# EasyEDA Pro project 4片ADS1299级联.epro, board PCB1
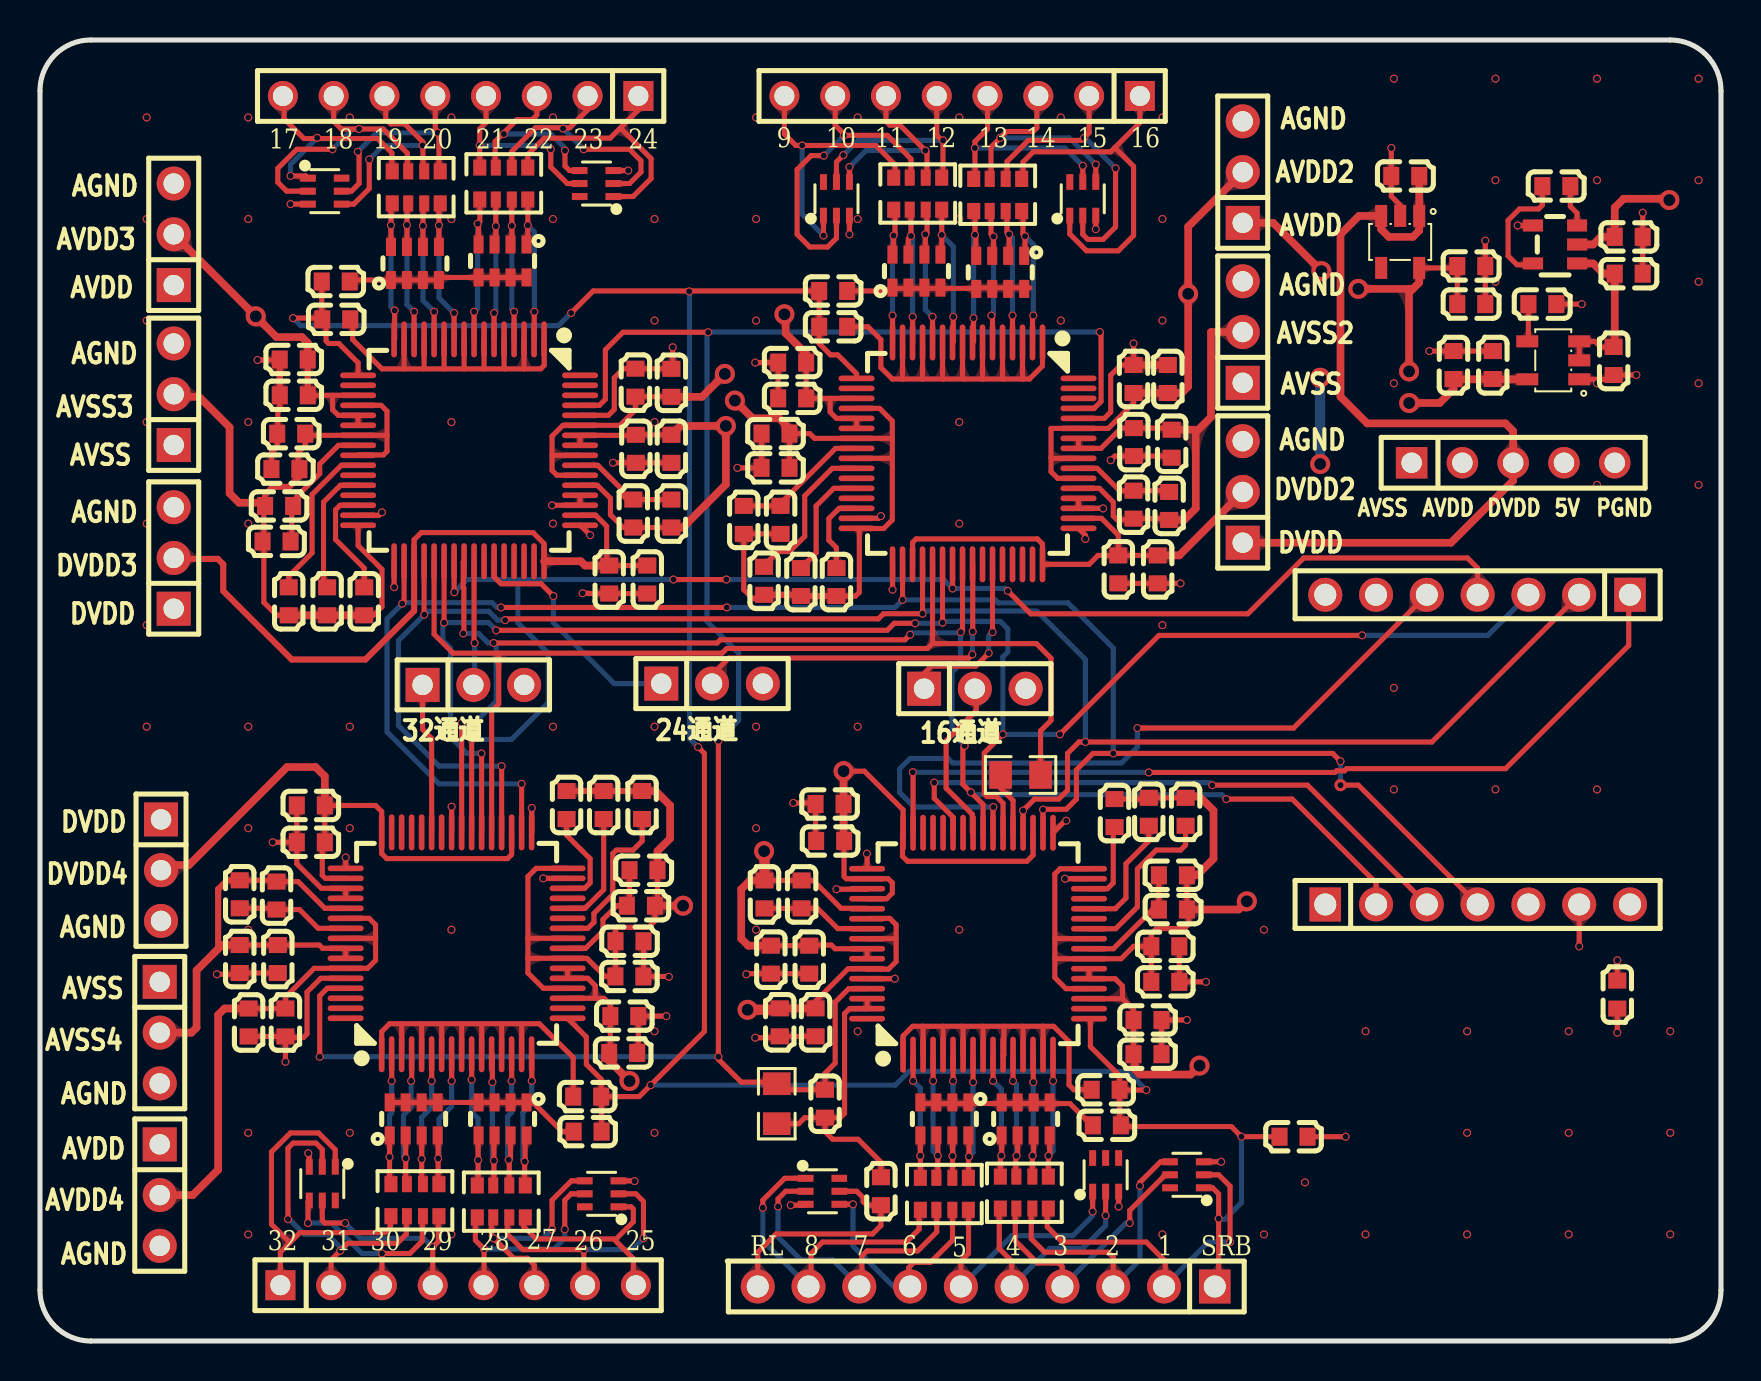
[diagram p4: board, top side]
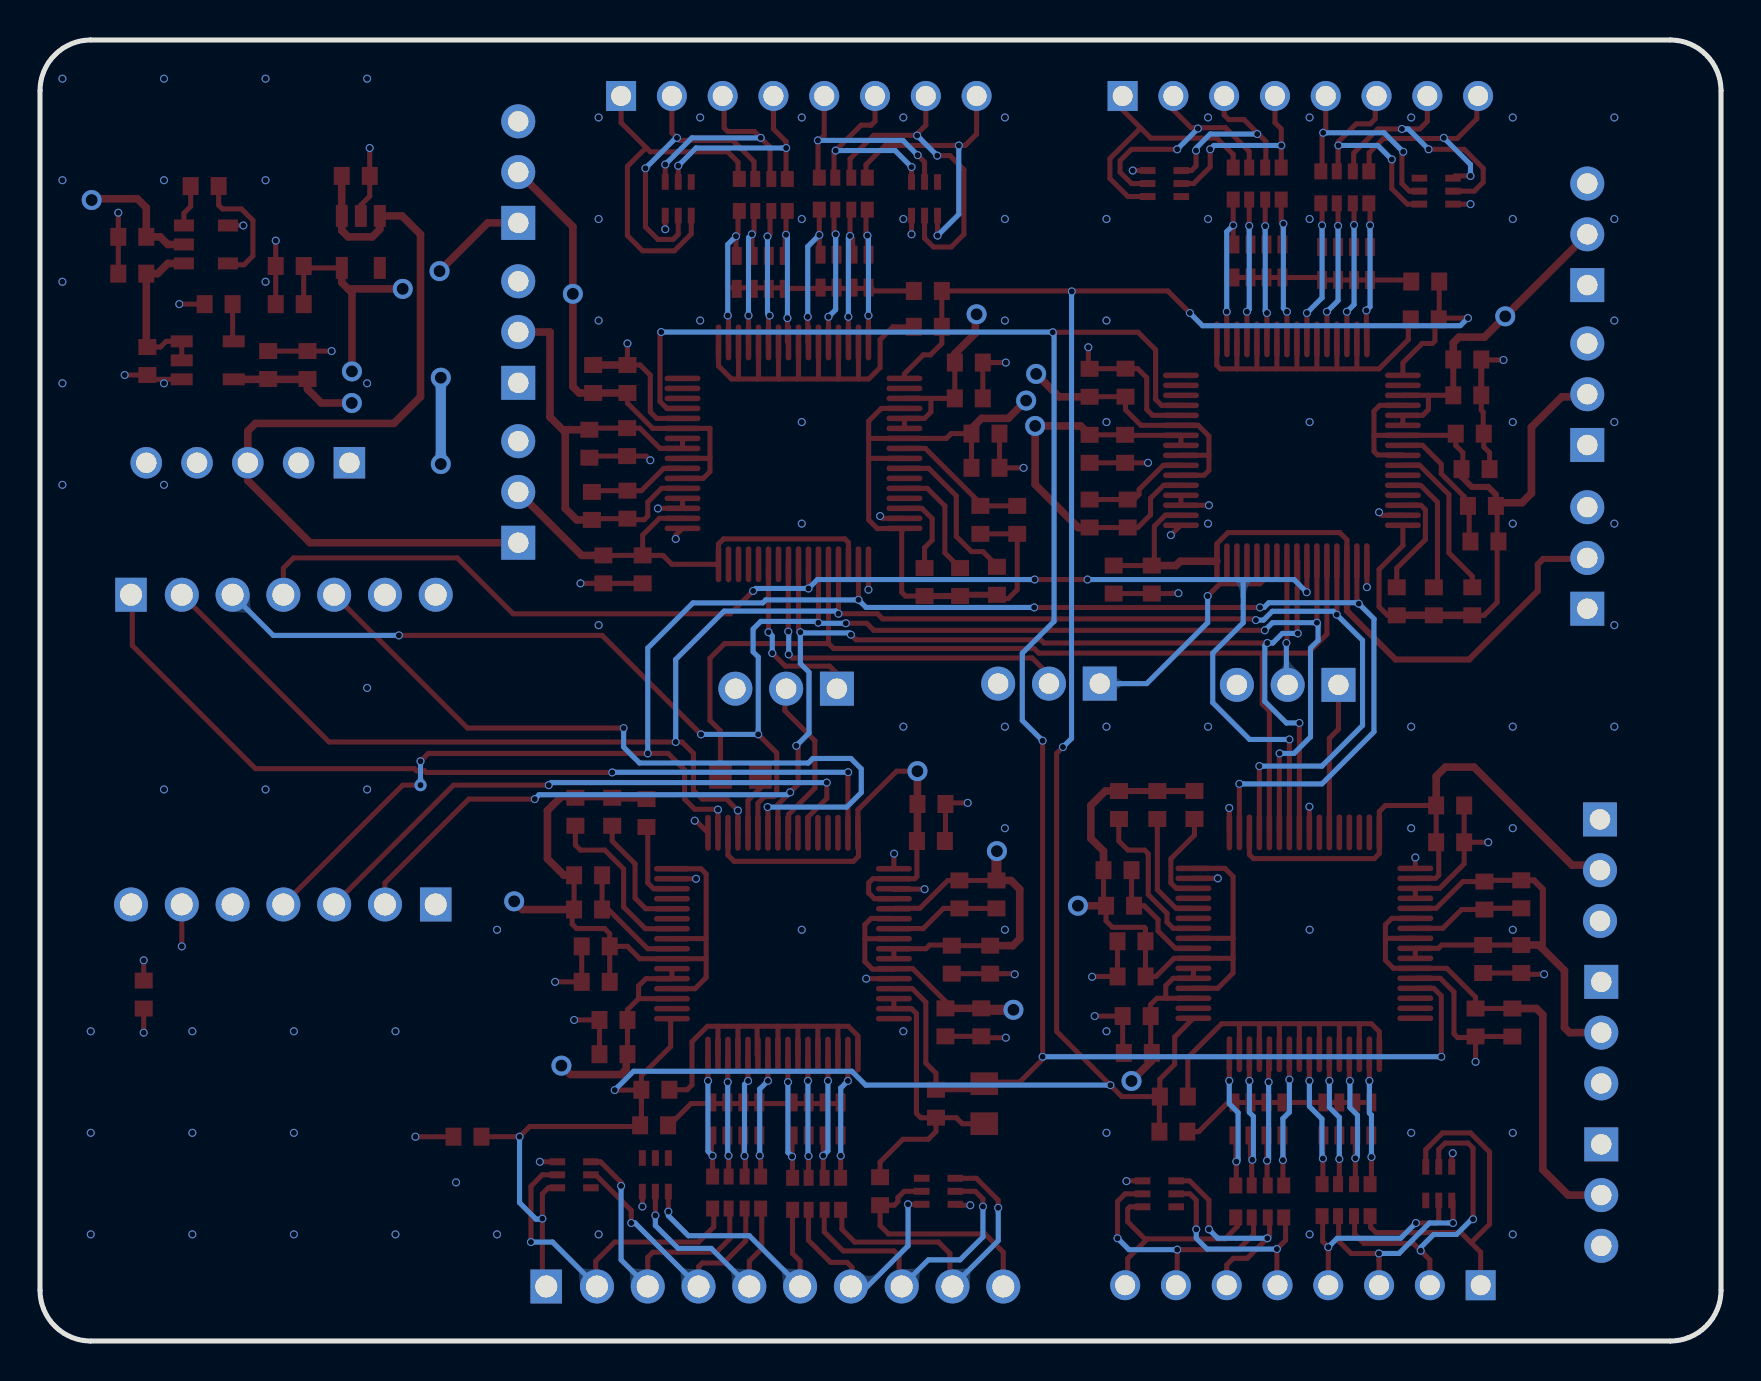
[diagram p5: board, bottom side, seen from below]

Outline 84.08 x 65.09 mm; copper layers: Top Layer, Inner1, Inner2, Bottom Layer. Coordinates in mm from the lower left corner of the outline.
Outline path: 0,62.55 0,2.54 arc(0.74,0.74) 2.54,0 81.54,0 arc(83.33,0.74) 84.08,2.54 84.08,62.55 arc(83.33,64.35) 81.54,65.09 2.54,65.09 arc(0.74,64.35) 0,62.55
Stack: Top Layer 0.035mm Outer layer thickness 1oz / Dielectric1 0.2104mm 7628 RC49% 8.6mil / Inner1 0.0152mm Inner layer thickness / Dielectric2 1.065mm 1.1mm H/HOZ Copper / Inner2 0.0152mm Inner layer thickness / Dielectric3 0.2104mm 7628 RC49% 8.6mil / Bottom Layer 0.035mm Outer layer thickness 1oz

## Design rules (mm)
spacing copperThickness1oz (default): track to track 0.152, other pairs 0.1 to 0.3
spacing copperThickness2oz: track to track 0.203, other pairs 0.152 to 0.3
spacing Plane_innerPlane: track to track 0.102, other pairs 0.1 to 0.3
spacing Copper_copperRegion: track to track 0.102, other pairs 0.1 to 0.3
track width copperThickness1oz (default): min 0.127, default 0.254, max 0.508
track width copperThickness2oz: min 0.203, default 0.254, max 2.54
differential pair differentialPair (default): width min 0.127, default 0.254, max 2.54; gap min 0.152, default 0.152
region e410 uses Copper_copperRegion
region e412 uses Copper_copperRegion
region e413 uses Copper_copperRegion
region e414 uses Copper_copperRegion
region e415 uses Copper_copperRegion
region e416 uses Copper_copperRegion
region e417 uses Copper_copperRegion
region e418 uses Copper_copperRegion
region e419 uses Copper_copperRegion
region e420 uses Copper_copperRegion
region e421 uses Copper_copperRegion
region e422 uses Copper_copperRegion
region e423 uses Copper_copperRegion
region e424 uses Copper_copperRegion
region e425 uses Copper_copperRegion
region e426 uses Copper_copperRegion
region e427 uses Copper_copperRegion
region e428 uses Copper_copperRegion
region e429 uses Copper_copperRegion
region e430 uses Copper_copperRegion
region e431 uses Copper_copperRegion
region e432 uses Copper_copperRegion
region e433 uses Copper_copperRegion
region e434 uses Copper_copperRegion
region e435 uses Copper_copperRegion
region e436 uses Copper_copperRegion
region e437 uses Copper_copperRegion
region e438 uses Copper_copperRegion
region e439 uses Copper_copperRegion
region e440 uses Copper_copperRegion
region e441 uses Copper_copperRegion
region e442 uses Copper_copperRegion
region e443 uses Copper_copperRegion
region e444 uses Copper_copperRegion
region e445 uses Copper_copperRegion
region e446 uses Copper_copperRegion
region e447 uses Copper_copperRegion
region e448 uses Copper_copperRegion
region e449 uses Copper_copperRegion
region e450 uses Copper_copperRegion
region e451 uses Copper_copperRegion
region e452 uses Copper_copperRegion
region e453 uses Copper_copperRegion
region e454 uses Copper_copperRegion
region e455 uses Copper_copperRegion
region e456 uses Copper_copperRegion
region e457 uses Copper_copperRegion
region e458 uses Copper_copperRegion
region e459 uses Copper_copperRegion

## Placement (name value [footprint] x y rotation side)
C10  2.2uF  [C0603]  78.71 49.03 270 top
C11  10uF  [C0603]  70.7 48.83 90 top
C12  0.01uF  [C0603]  72.67 48.83 90 top
C13  2.2uF  [C0603]  75.14 51.88 0 top
C15  2.2uF  [C0603]  68.28 58.29 180 top
C18  2.2uF  [C0603]  71.59 53.78 0 top
C19  10uF  [C0603]  71.59 51.88 0 top
C38  10uF  [C0603]  56.66 21.59 180 top
C39  100nF  [C0603]  56.66 23.3 180 top
C40  1uF  [C0603]  57.3 26.48 270 top
C43  1uF  [C0603]  53.74 26.41 270 top
C45  100nF  [C0603]  38.09 22.34 270 top
C46  1uF  [C0603]  36.24 22.34 90 top
C54  10uF  [C0603]  79.46 55.24 180 top
C55  10uF  [C0603]  75.84 57.78 0 top
C56  10uF  [C0603]  79.46 53.4 180 top
C57  1nF  [C0603]  39.26 11.87 270 top
C77  10uF  [C0603]  37.04 41.08 90 top
C78  100nF  [C0603]  35.2 41.08 90 top
C79  1uF  [C0603]  36.22 38.03 90 top
C81  1uF  [C0603]  39.84 37.97 90 top
C82  100nF  [C0603]  54.69 41.84 90 top
C83  1uF  [C0603]  56.47 41.78 270 top
C86  100uF  [C0603]  55.46 26.48 270 top
C87  100uF  [C0603]  38.06 37.97 90 top
C88  1uF  [C0603]  37.62 48.95 180 top
C89  100nF  [C0603]  37.62 47.16 180 top
C90  1uF  [C0603]  36.79 43.69 0 top
C91  100nF  [C0603]  36.79 45.4 0 top
C92  1uF  [C0603]  56.41 48.13 270 top
C93  100nF  [C0603]  54.69 48.13 270 top
C94  1uF  [C0603]  54.71 44.97 270 top
C95  100nF  [C0603]  56.6 44.89 270 top
C96  1uF  [C0603]  55.39 14.35 0 top
C97  100nF  [C0603]  55.39 16.06 0 top
C98  1uF  [C0603]  56.28 19.75 0 top
C99  100nF  [C0603]  56.28 17.97 0 top
C100  1uF  [C0603]  36.55 19.08 270 top
C101  100nF  [C0603]  38.47 19.08 270 top
C102  1uF  [C0603]  37 15.94 90 top
C103  100nF  [C0603]  38.79 15.94 90 top
C104  10uF  [C0603]  11.83 40 0 top
C105  100nF  [C0603]  11.96 41.78 0 top
C106  1uF  [C0603]  12.44 37.01 90 top
C107  1uF  [C0603]  16.22 37.01 90 top
C108  100nF  [C0603]  31.58 41.4 90 top
C109  1uF  [C0603]  29.68 41.4 270 top
C112  100uF  [C0603]  14.36 37.01 90 top
C113  1uF  [C0603]  12.69 49.11 180 top
C114  100nF  [C0603]  12.69 47.32 180 top
C115  1uF  [C0603]  12.28 43.62 0 top
C116  100nF  [C0603]  12.57 45.4 0 top
C117  1uF  [C0603]  29.78 47.95 270 top
C118  100nF  [C0603]  31.58 47.94 270 top
C119  1uF  [C0603]  31.58 44.64 270 top
C120  100nF  [C0603]  29.8 44.64 270 top
C121  10uF  [C0603]  30.18 23.56 180 top
C122  100nF  [C0603]  30.06 21.78 180 top
C123  1uF  [C0603]  30.11 26.82 270 top
C124  1uF  [C0603]  26.34 26.82 270 top
C125  100nF  [C0603]  11.83 22.29 270 top
C126  1uF  [C0603]  9.99 22.35 90 top
C129  100uF  [C0603]  28.19 26.82 270 top
C130  1uF  [C0603]  29.17 14.41 0 top
C131  100nF  [C0603]  29.23 16.26 0 top
C132  1uF  [C0603]  29.48 20 180 top
C133  100nF  [C0603]  29.48 18.24 180 top
C134  1uF  [C0603]  12.28 15.94 90 top
C135  100nF  [C0603]  10.44 15.94 90 top
C136  1uF  [C0603]  9.99 19.11 270 top
C137  100nF  [C0603]  11.9 19.11 270 top
C142  100nF  [C0603]  39.52 25.02 0 top
C143  1uF  [C0603]  39.49 26.87 0 top
C144  1uF  [C0603]  55.9 38.61 90 top
C145  100nF  [C0603]  53.93 38.61 90 top
C146  1uF  [C0603]  30.37 38.1 90 top
C147  100nF  [C0603]  28.47 38.1 90 top
C148  1uF  [C0603]  13.55 26.8 0 top
C149  100nF  [C0603]  13.55 24.95 0 top
C150  470pF  [CAP-ARRAY-SMD_0612-8P-L3.2-W1.6-BL]  45.23 11.11 180 top
C151  470pF  [CAP-ARRAY-SMD_0612-8P-L3.2-W1.6-BL]  49.3 11.11 0 top
C152  470pF  [CAP-ARRAY-SMD_0612-8P-L3.2-W1.6-BL]  43.84 53.53 0 top
C153  470pF  [CAP-ARRAY-SMD_0612-8P-L3.2-W1.6-BL]  48.03 53.47 180 top
C154  470pF  [CAP-ARRAY-SMD_0612-8P-L3.2-W1.6-BL]  18.75 53.91 0 top
C155  470pF  [CAP-ARRAY-SMD_0612-8P-L3.2-W1.6-BL]  23.14 54.04 180 top
C156  470pF  [CAP-ARRAY-SMD_0612-8P-L3.2-W1.6-BL]  23.14 11.11 180 top
C157  470pF  [CAP-ARRAY-SMD_0612-8P-L3.2-W1.6-BL]  18.69 11.11 0 top
H7  PZ254V-11-10P  [HDR-TH_10P-P2.54-V-M]  47.33 2.73 180 top
H8  PZ254V-11-08P  [HDR-TH_8P-P2.54-V-M]  46.12 62.29 180 top
H9  PZ254V-11-08P  [HDR-TH_8P-P2.54-V-M]  21.04 62.29 180 top
H10  PZ254V-11-08P  [HDR-TH_8P-P2.54-V-M]  20.91 2.79 0 top
H12  PM254V-11-07-H85  [HDR-TH_7P-P2.54-V-F]  71.9 21.84 0 top
H13  PM254V-11-07-H85  [HDR-TH_7P-P2.54-V-F]  71.9 37.34 180 top
H14  2.54-1*5P母  [HDR-TH_5P-P2.54-V-F]  73.68 43.94 0 top
H15  PZ254V-11-03P  [HDR-TH_3P-P2.54-V-M_PZ254V-11-03P]  46.76 32.64 0 top
H16  PZ254V-11-03P  [HDR-TH_3P-P2.54-V-M_PZ254V-11-03P]  33.61 32.89 0 top
H17  PZ254V-11-03P  [HDR-TH_3P-P2.54-V-M_PZ254V-11-03P]  21.67 32.83 0 top
H18  PZ254V-11-03P  [HDR-TH_3P-P2.54-V-M_PZ254V-11-03P]  60.16 58.48 90 top
H19  PZ254V-11-03P  [HDR-TH_3P-P2.54-V-M_PZ254V-11-03P]  60.16 42.48 90 top
H20  PZ254V-11-03P  [HDR-TH_3P-P2.54-V-M_PZ254V-11-03P]  60.16 50.48 90 top
H21  PZ254V-11-03P  [HDR-TH_3P-P2.54-V-M_PZ254V-11-03P]  6.69 55.37 90 top
H22  PZ254V-11-03P  [HDR-TH_3P-P2.54-V-M_PZ254V-11-03P]  6.69 39.18 90 top
H23  PZ254V-11-03P  [HDR-TH_3P-P2.54-V-M_PZ254V-11-03P]  6.69 47.37 90 top
H24  PZ254V-11-03P  [HDR-TH_3P-P2.54-V-M_PZ254V-11-03P]  5.99 7.3 270 top
H25  PZ254V-11-03P  [HDR-TH_3P-P2.54-V-M_PZ254V-11-03P]  6.05 23.56 270 top
H26  PZ254V-11-03P  [HDR-TH_3P-P2.54-V-M_PZ254V-11-03P]  5.99 15.43 270 top
R2  100kΩ  [C0603]  42.06 7.5 270 top
R11  1MΩ  [R0805]  36.85 11.87 270 top
R15  0Ω  [C0603]  53.36 10.79 180 top
R19  0Ω  [C0603]  53.3 12.57 180 top
R33  0Ω  [C0603]  39.67 52.54 0 top
R36  0Ω  [C0603]  39.67 50.74 0 top
R41  0Ω  [C0603]  14.82 51.12 0 top
R48  50Ω  [R0805]  49.04 28.32 180 top
R52  0Ω  [C0603]  27.37 12.23 180 top
R54  0Ω  [C0603]  14.79 53.01 0 top
R56  0Ω  [C0603]  27.39 10.48 180 top
R57  0Ω  [C0603]  78.89 17.33 90 top
R58  0Ω  [C0603]  62.7 10.22 180 top
RN16  10kΩ  [RES-ARRAY-SMD_0603-8P-L3.2-W1.6-BL]  45.23 7.36 180 top
RN17  10kΩ  [RES-ARRAY-SMD_0603-8P-L3.2-W1.6-BL]  49.23 7.43 180 top
RN18  10kΩ  [RES-ARRAY-SMD_0603-8P-L3.2-W1.6-BL]  43.9 57.4 0 top
RN19  10kΩ  [RES-ARRAY-SMD_0603-8P-L3.2-W1.6-BL]  47.9 57.34 0 top
RN20  10kΩ  [RES-ARRAY-SMD_0603-8P-L3.2-W1.6-BL]  18.82 57.72 0 top
RN21  10kΩ  [RES-ARRAY-SMD_0603-8P-L3.2-W1.6-BL]  23.2 57.91 0 top
RN22  10kΩ  [RES-ARRAY-SMD_0603-8P-L3.2-W1.6-BL]  23.07 6.98 180 top
RN23  10kΩ  [RES-ARRAY-SMD_0603-8P-L3.2-W1.6-BL]  18.75 7.05 180 top
U1  ADS1299IPAGR  [TQFP-64_L10.0-W10.0-P0.50-LS12.0-TL]  46.92 19.88 90 top
U3  TLV70025DDCR  [SOT-23-5_L3.0-W1.7-P0.95-LS2.8-BR]  68.03 54.99 90 top
U11  TPD4E1B06DCKR  [SC-70-6_L2.2-W1.3-P0.65-LS2.1-BL]  39.14 7.49 270 top
U16  TPD4E1B06DCKR  [SC-70-6_L2.2-W1.3-P0.65-LS2.1-BL]  57.36 8.32 90 top
U17  TPD4E1B06DCKR  [SC-70-6_L2.2-W1.3-P0.65-LS2.1-BL]  53.3 8.32 0 top
U21  TPS60401QDBVRQ1  [SOT-23-5_L2.9-W1.6-P0.95-LS2.8-BR]  75.78 54.86 0 top
U22  TPS72325DBVR  [SOT-23-5_L3.0-W1.7-P0.95-LS2.8-BR]  75.69 49.07 0 top
U32  ADS1299IPAGR  [TQFP-64_L10.0-W10.0-P0.50-LS12.0-TL]  46.39 44.41 270 top
U37  TPD4E1B06DCKR  [SC-70-6_L2.2-W1.3-P0.65-LS2.1-BL]  52.15 57.15 0 top
U39  TPD4E1B06DCKR  [SC-70-6_L2.2-W1.3-P0.65-LS2.1-BL]  39.84 57.15 0 top
U48  ADS1299IPAGR  [TQFP-64_L10.0-W10.0-P0.50-LS12.0-TL]  21.46 44.56 270 top
U53  ADS1299IPAGR  [TQFP-64_L10.0-W10.0-P0.50-LS12.0-TL]  20.84 19.9 90 top
U58  TPD4E1B06DCKR  [SC-70-6_L2.2-W1.3-P0.65-LS2.1-BL]  27.83 57.91 90 top
U59  TPD4E1B06DCKR  [SC-70-6_L2.2-W1.3-P0.65-LS2.1-BL]  14.24 57.53 270 top
U60  TPD4E1B06DCKR  [SC-70-6_L2.2-W1.3-P0.65-LS2.1-BL]  14.12 7.87 180 top
U61  TPD4E1B06DCKR  [SC-70-6_L2.2-W1.3-P0.65-LS2.1-BL]  28.09 7.36 90 top

## Footprints (pads in the part's own frame, mm; a bottom-side part is the same pattern mirrored in y, then rotated)
C0603
  rect 0.8x0.9 smd: 1(-0.7,0) 2(0.7,0)
CAP-ARRAY-SMD_0612-8P-L3.2-W1.6-BL
  rect 0.5x0.9 smd: 1(-1.2,-0.825) 2(-0.4,-0.825) 3(0.4,-0.825) 4(1.2,-0.825) 5(1.2,0.825) 6(0.4,0.825) 7(-0.4,0.825) 8(-1.2,0.825)
HDR-TH_3P-P2.54-V-M_PZ254V-11-03P
  rect 1.7x1.7 hole 1.02: 1(-2.54,0)
  round 1.7 hole 1.02: 2(0,0) 3(2.54,0)
HDR-TH_5P-P2.54-V-F
  rect 1.575x1.575 hole 1.02: 1(-5.08,0)
  round 1.575 hole 1.02: 2(-2.54,0) 3(0,0) 4(2.54,0) 5(5.08,0)
HDR-TH_7P-P2.54-V-F
  rect 1.575x1.7 hole 1.1: 1(-7.62,0)
  round 1.7 hole 1.1: 2(-5.08,0) 3(-2.54,0) 4(0,0) 5(2.54,0) 6(5.08,0) 7(7.62,0)
HDR-TH_8P-P2.54-V-M
  rect 1.5x1.5 hole 1: 1(-8.89,0)
  round 1.5 hole 1: 2(-6.35,0) 3(-3.81,0) 4(-1.27,0) 5(1.27,0) 6(3.81,0) 7(6.35,0) 8(8.89,0)
HDR-TH_10P-P2.54-V-M
  rect 1.575x1.7 hole 1.1: 1(-11.43,0)
  round 1.7 hole 1.1: 2(-8.89,0) 3(-6.35,0) 4(-3.81,0) 5(-1.27,0) 6(1.27,0) 7(3.81,0) 8(6.35,0) 9(8.89,0) 10(11.43,0)
R0805
  rect 1.133x1.377 smd: 1(-1,0) 2(1,0)
RES-ARRAY-SMD_0603-8P-L3.2-W1.6-BL
  rect 0.65x0.8 smd: 1(-1.2,-0.8) 4(1.2,-0.8) 5(1.2,0.8) 8(-1.2,0.8)
  rect 0.5x0.8 smd: 2(-0.4,-0.8) 3(0.4,-0.8) 6(0.4,0.8) 7(-0.4,0.8)
SC-70-6_L2.2-W1.3-P0.65-LS2.1-BL
  rect 0.35x0.78 smd: 1(-0.65,-0.84) 2(0,-0.84) 3(0.65,-0.84) 4(0.65,0.84) 5(0,0.84) 6(-0.65,0.84)
SOT-23-5_L2.9-W1.6-P0.95-LS2.8-BR
  rect 1x0.6 smd: 1(1.1,-0.95) 2(1.1,0) 3(1.1,0.95) 4(-1.1,0.95) 5(-1.1,-0.95)
SOT-23-5_L3.0-W1.7-P0.95-LS2.8-BR
  rect 1.1x0.6 smd: 1(1.3,-0.95) 2(1.3,0) 3(1.3,0.95) 4(-1.3,0.95) 5(-1.3,-0.95)
TQFP-64_L10.0-W10.0-P0.50-LS12.0-TL
  oval 1.8x0.28 smd: 1(-5.55,3.75) 2(-5.55,3.25) 3(-5.55,2.75) 4(-5.55,2.25) 5(-5.55,1.75) 6(-5.55,1.25) 7(-5.55,0.75) 8(-5.55,0.25) 9(-5.55,-0.25) 10(-5.55,-0.75) 11(-5.55,-1.25) 12(-5.55,-1.75) 13(-5.55,-2.25) 14(-5.55,-2.75) 15(-5.55,-3.25) 16(-5.55,-3.75) 33(5.55,-3.75) 34(5.55,-3.25) 35(5.55,-2.75) 36(5.55,-2.25) 37(5.55,-1.75) 38(5.55,-1.25) 39(5.55,-0.75) 40(5.55,-0.25) 41(5.55,0.25) 42(5.55,0.75) 43(5.55,1.25) 44(5.55,1.75) 45(5.55,2.25) 46(5.55,2.75) 47(5.55,3.25) 48(5.55,3.75)
  oval 0.28x1.8 smd: 17(-3.75,-5.55) 18(-3.25,-5.55) 19(-2.75,-5.55) 20(-2.25,-5.55) 21(-1.75,-5.55) 22(-1.25,-5.55) 23(-0.75,-5.55) 24(-0.25,-5.55) 25(0.25,-5.55) 26(0.75,-5.55) 27(1.25,-5.55) 28(1.75,-5.55) 29(2.25,-5.55) 30(2.75,-5.55) 31(3.25,-5.55) 32(3.75,-5.55) 49(3.75,5.55) 50(3.25,5.55) 51(2.75,5.55) 52(2.25,5.55) 53(1.75,5.55) 54(1.25,5.55) 55(0.75,5.55) 56(0.25,5.55) 57(-0.25,5.55) 58(-0.75,5.55) 59(-1.25,5.55) 60(-1.75,5.55) 61(-2.25,5.55) 62(-2.75,5.55) 63(-3.25,5.55) 64(-3.75,5.55)

## Nets
As in the schematic, except:
IN1P: C151.4 RN17.1 U1.16
IN2P: C151.3 RN17.2 U1.14
IN3P: C151.2 RN17.3 U1.12
IN4P: C151.1 RN17.4 U1.10
IN5P: C150.8 RN16.1 U1.8
IN6P: C150.7 RN16.2 U1.6
IN7P: C150.6 RN16.3 U1.4
IN8P: C150.5 RN16.4 U1.2
SRB: H7.1 R15.1 R19.1 R33.1 R36.1 R41.1 R52.1 R54.1 R56.1 R58.2 U1.17 U16.1 U32.17 U48.17 U53.17

Pads without a net: H12 1; H13 6 7; U1 18 27 29 42 44 45 46 64; U3 4; U11 6; U16 6; U17 4 5 6; U32 18 27 29 42 44 45 46 47 62 63 64; U37 6; U39 6; U48 18 27 29 42 44 45 46 47 62 63 64; U53 18 27 29 42 44 45 46 47 62 63 64; U58 6; U59 6; U60 6; U61 6

## Via types
v1: diameter 1.001, hole 0.6, Top Layer to Bottom Layer, 20 vias
v2: diameter 0.399, hole 0.299, Top Layer to Bottom Layer, 85 vias
v3: diameter 0.4, hole 0.3, Top Layer to Bottom Layer, 232 vias
v4: diameter 0.61, hole 0.305, Top Layer to Bottom Layer, 1 via
v5: diameter 0.391, hole 0.297, Top Layer to Bottom Layer, 1 via

## Routing (per net, layer and track width the routed paths; a pad name or vN(x,y) marks a point on that pad's centre or on a via; arc(x,y) is an arc through that point)
5V: length 51.8
  Top Layer w0.381: v1(81.49,57.08) 81.43,57.15 79.21,57.15 78.76,56.7 C54.2 78.06,55.24 77.68,54.86 U21.2
  Inner2 w0.508: H12.7 81.68,21.84 82.7,22.86 82.7,40.19 81.3,41.59 77.43,41.59 76.22,42.8 H14.4 76.98,43.94 81.49,48.45 v1(81.49,57.08)
-5V: length 8.7
  Top Layer w0.254: U22.2 U22.3 77.77,50.02 78.05,49.73 C10.1 ; U21.1 76.98,53.81
  Top Layer w0.381: U21.1 77.68,53.91 78.19,53.4 C56.2 78.76,49.78 C10.1
AGND: length 111.6
  Top Layer w0.254: v2(25.61,41.81) U48.51 U48.52 ; C148.1 C149.1 ; C149.1 12.85,23.88 14.08,22.65 U53.51 U53.52 ; C149.1 v2(11.64,24.95) ; U16.3 v2(59.08,8.97) ; C103.1 37,15.24 ; v2(24.6,26.67) 24.6,25.45 U53.33 ; v2(31.64,49.72) 31.64,48.7 C118.1 31.57,48.65 C117.1 29.18,48.65 28.72,48.19 28.72,46.61 28.43,46.31 U48.60 ; v2(37.68,26.92) 38.74,26.92 C143.1 38.79,25.05 C142.1 ; v2(51.33,26.03) 51.27,26.03 U1.33 ; v2(52.28,40.13) 52.28,40.32 U32.49 ; R58.1 v3(65.3,10.22) ; U32.31 41.95,41.16 v2(42.06,41.27) ; C146.1 C147.1 27.45,37.4 27.44,37.41 v2(27.14,37.41) ; v2(57.36,16.06) C97.2 C96.2 ; v2(29.74,8) 29.72,8.01 U61.3 ; U1.51 41.34,22.6 v2(39.84,22.6) ; U48.31 16.95,41.31 v2(17.1,41.46) ; v2(35.33,18.35) 35.36,18.38 C100.2 C101.2 ; C114.2 11.99,46.58 11.9,46.48 11.9,45.42 11.87,45.4 11.87,44.74 11.58,44.45 C115.1 ; v2(41.36,24.38) 41.37,24.37 U1.49 ; U32.33 v2(42.64,37.59) ; U48.49 27.02,40.81 v2(27.52,40.32) ; U53.41 v2(20.59,26.73) ; U37.3 v2(52.8,55.62) ; U32.60 53.23,46.16 53.55,46.48 53.55,48.32 54.06,48.83 C93.1 v2(54.69,49.91) ; v2(10.88,49.08) 11.97,49.08 C113.2 ; U39.3 v2(40.49,55.37) ; U17.3 v2(53.95,6.73) ; v2(34.88,43.69) C90.1 C91.1 ; 36.92,47.16 C88.2 v2(35.77,48.95) ; v2(31.33,16.26) C131.2 29.93,14.47 C130.2 ; C134.1 v2(12.28,13.97) ; C134.1 12.33,15.19 13.18,15.19 13.36,15.37 13.36,17.46 14.04,18.15 U53.60 ; C134.1 C135.1 ; C119.2 C120.2 v2(28.66,43.94) ; C137.2 C136.2 9.93,18.35 v2(8.85,18.35) ; R57.1 v2(78.89,15.43) ; U53.31 v2(25.17,23.15) ; U11.3 38.25,6.79 v2(37.55,6.79) ; v2(53.17,41.65) 53.16,41.66 U32.51 U32.52 ; v2(13.42,9.4) 13.47,9.35 U60.3 ; U1.60 v2(42.76,18.13) ; v2(31.45,18.22) 31.44,18.24 C133.1 30.18,18.25 C132.1 ; U1.31 v2(51.27,23.13) ; U48.33 v2(17.71,37.72) ; v2(58.31,17.97) C99.2 C98.2 ; C145.1 C144.1 v2(57.04,37.91) ; v2(53.55,44.07) 53.76,44.27 C94.2 56.52,44.27 C95.2 ; U58.3 v2(29.42,58.56) ; 36.93,15.17 v2(35.77,15.17) ; U59.3 v2(12.53,56.88) ; U53.49 v2(15.29,24.19)
  Top Layer w0.305: C113.2 11.99,47.32
  Top Layer w0.381: C93.1 C92.1
  vias: v3(5.34,61.22) v3(5.34,56.14) v3(5.34,51.06) v3(5.34,45.98) v3(5.34,40.9) v3(5.34,35.82) v3(5.34,30.74) v3(10.42,61.22) v3(10.42,56.14) v3(10.42,45.98) v3(10.42,40.9) v3(10.42,30.74) v3(10.42,25.66) v3(10.42,20.58) v3(10.42,10.42) v3(10.42,5.34) v3(15.5,61.22) v3(15.5,30.74) v3(15.5,25.66) v3(15.5,10.42) v3(20.58,61.22) v3(20.58,56.14) v3(20.58,45.98) v3(20.58,20.58) v3(20.58,5.34) v3(25.66,61.22) v3(25.66,56.14) v3(25.66,40.9) v3(25.66,30.74) v3(30.74,56.14) v3(30.74,51.06) v3(30.74,45.98) v3(30.74,30.74) v3(30.74,15.5) v3(30.74,10.42) v3(35.82,61.22) v3(35.82,56.14) v3(35.82,51.06) v3(35.82,30.74) v3(35.82,25.66) v3(35.82,20.58) v3(40.9,61.22) v3(40.9,56.14) v3(40.9,30.74) v3(40.9,15.5) v3(45.98,61.22) v3(45.98,56.14) v3(45.98,45.98) v3(45.98,40.9) v3(45.98,20.58) v3(51.06,61.22) v3(51.06,51.06) v3(56.14,61.22) v3(56.14,56.14) v3(56.14,51.06) v3(56.14,35.82) v3(56.14,5.34) v3(61.22,20.58) v3(61.22,5.34) v3(63.27,7.94) v3(66.3,15.5) v3(66.3,5.34) v3(71.38,15.5) v3(71.38,10.42) v3(71.38,5.34) v3(76.46,15.5) v3(76.46,10.42) v3(76.46,5.34) v3(81.54,15.5) v3(81.54,10.42) v3(81.54,5.34)
AVDD: length 225.8
  Top Layer w0.254: C19.1 C18.1 70.79,53.69 U3.5 ; U1.19 54.14,17.13 ; 54.14,17.13 54.69,16.57 C97.1 C96.1 ; 54.14,17.13 54.14,17.76 53.77,18.13 U1.21 U1.22 ; 42.82,20.13 42.82,20.83 42.5,21.14 41.45,21.14 ; 42.82,20.13 U1.56 ; 42.82,20.13 42.82,18.98 42.44,18.6 41.39,18.6 U1.59 40.42,18.63 38.79,17 C103.2
  Top Layer w0.381: C96.1 54.76,14.28 54.76,13.59 55.01,13.33 57.55,13.33 v1(58,13.78) ; 68.66,52.64 68.47,52.45 v1(68.47,48.51) ; 68.66,52.64 v1(65.93,52.64) ; 68.66,52.64 68.98,52.95 U3.5 ; v1(64.09,53.53) 61.68,55.94 H18.1 ; C103.2 37,16.64
  Top Layer w0.508: C102.2 36.93,16.57 v1(35.39,16.57)
  Inner2 w0.508: H14.2 71.14,45.85 v1(68.47,48.51) ; v1(65.93,52.64) 64.98,52.64 v1(64.09,53.53) ; v1(64.03,48.19) 64.03,52.07 H18.1 57.81,55.94 56.47,57.28 17.29,57.28 12.85,52.83 H21.1 4.47,52.83 2.5,50.86 2.5,11.75 4.47,9.78 5.93,9.78 H24.1 ; v1(35.39,16.57) 55.2,16.57 v1(58,13.78) 60.22,13.78 62.44,16 62.44,25.25 63.01,25.82 63.01,42.86 v1(64.03,43.88)
  Bottom Layer w0.508: v1(64.03,48.19) v1(64.03,43.88)
AVDD2: length 55.3
  Top Layer w0.254: 50.57,44.21 50.57,45.66 U32.59 53.43,45.66 54.69,46.92 C93.2 ; 50.57,44.21 50.57,43.5 50.9,43.16 U32.54 ; 50.57,44.21 50.62,44.16 U32.56 ; 38.32,48.95 C89.1 39.53,47.16 ; 39.53,47.16 39.52,47.15 39.52,46.48 39.84,46.16 U32.21 U32.22 ; 39.53,47.16 40.84,47.16 U32.19
  Top Layer w0.381: H18.2 57.42,55.75 v1(57.42,52.39) 57.42,47.75 57.11,47.43 C92.2 C93.2 ; C88.1 38.32,49.39 37.3,50.42 37.3,51.31 v1(37.23,51.37)
  Inner2 w0.508: v1(57.42,52.39) 38.32,52.39 37.3,51.37
AVDD3: length 56.3
  Top Layer w0.254: U48.22 U48.21 14.92,46.31 14.63,46.6 14.63,47.32 ; 14.63,47.32 15.91,47.32 U48.19 ; 14.63,47.32 C114.1 ; 25.61,44.29 25.61,43.56 25.86,43.31 U48.54 ; 25.61,44.29 25.64,44.31 U48.56 ; 25.61,44.29 25.61,45.27 26.15,45.81 U48.59 29.01,45.81 29.78,46.59 C117.2 31.57,47.25 C118.2
  Top Layer w0.305: C113.1 13.39,47.32
  Top Layer w0.381: v1(34.25,48.39) 33.11,47.24 C118.2 ; H21.2 v1(10.79,51.27) 11.83,50.23 13.1,50.23 13.39,49.94 C113.1
  Inner2 w0.508: v1(10.79,51.27) 13.67,48.39 v1(34.25,48.39)
AVDD4: length 60.4
  Top Layer w0.254: U53.56 16.74,20.15 ; 16.74,20.15 16.79,20.15 ; 16.74,20.15 16.79,20.2 ; 16.79,20.2 16.79,20.15 ; 16.79,20.2 16.79,20.83 16.46,21.15 U53.54 ; 16.79,20.15 16.79,19.05 16.38,18.65 U53.59 13.72,18.65 12.28,17.21 C134.2 C135.2 ; U53.19 27.75,17.15 ; 27.75,17.15 27.77,17.17 27.77,17.78 27.4,18.15 U53.21 U53.22 ; 27.75,17.15 28.21,17.15 28.53,16.83 28.53,16.26 C131.1 28.53,14.47 C130.1
  Top Layer w0.381: C135.2 9.23,16.64 8.91,16.32 8.91,8.57 7.64,7.3 H24.2 ; v1(29.48,13.01) 28.47,14.03 C130.1
  Inner2 w0.508: 29.36,12.95 26.82,10.41 16.91,10.41 13.8,7.3 H24.2
AVSS: length 210.3
  Top Layer w0.254: 53.68,27.11 55.39,27.11 C86.1 57.23,27.18 57.3,27.24 ; C39.1 C38.1 57.46,21.5 57.46,20.86 57.23,20.64 55.84,20.64 55.58,20.38 55.58,19.75 ; 50.76,20.13 50.76,23.37 51.02,23.63 U1.32 ; 50.76,20.13 52.46,20.13 U1.25 ; 50.76,20.13 50.76,19.14 ; C99.1 C98.1 54.69,19.75 54.08,19.13 U1.23 50.77,19.13 50.76,19.14 ; 50.76,19.14 50.76,18.18 51.31,17.63 U1.20 ; C100.1 C101.1 38.51,19.81 39.58,19.81 39.76,19.63 U1.57 U1.58 ; 41.34,21.65 40.07,21.65 38.67,23.04 C45.1 C46.2
  Top Layer w0.381: 70.7,48.19 70.77,48.12 U22.5 ; C46.2 35.51,23.04 35.07,22.6 35.07,20.13 35.42,19.78 C100.1 ; C39.1 57.87,23.3 58.7,24.13 58.7,26.54 57.99,27.24 57.3,27.24 ; C38.1 59.95,21.59 v1(60.36,22) ; C11.1 70.7,47.62 70,46.93 v1(68.48,46.93)
  Top Layer w0.508: C46.2 36.24,24.49 v1(36.22,24.51)
  Inner2 w0.508: H20.1 61.93,47.94 65.81,44.06 68.48,44.06 ; H20.1 57.42,47.94 54.19,44.7 5.36,44.7 3.89,43.24 3.89,19.37 5.29,17.97 H26.1 ; H20.1 60.22,47.88 60.22,46.67 60.58,46.31 60.93,46.31 61.44,45.8 61.44,23.08 v1(60.36,22) 60.11,21.75 38.98,21.75 v1(36.22,24.51) ; 68.48,44.06 v1(68.48,46.93) ; 68.48,44.06 H14.1
AVSS2: length 87
  Top Layer w0.254: 42.63,44.2 42.63,41.08 42.2,40.65 40.85,40.65 ; 42.63,44.2 42.63,45.14 ; 42.63,44.2 42.59,44.16 U32.25 ; U32.20 41.99,46.66 42.63,46.03 42.63,45.14 ; 42.63,45.14 42.61,45.16 U32.23 38.74,45.16 38.5,45.4 C91.2 C90.2 ; U32.32 40.85,40.65 ; 40.85,40.65 40.98,40.52 40.98,37.46 40.79,37.27 C81.1 ; U32.53 52.99,42.66 53.68,41.97 53.68,41.27 53.86,41.09 54.64,41.09 C82.1 56.41,41.14 C83.2 ; C79.1 36.03,37.15 35.64,37.15 35.2,37.59 C78.1 C77.1 ; U32.58 U32.57 53.06,44.66 54.08,45.67 C94.1 56.52,45.67 C95.1
  Top Layer w0.305: C79.1 37.99,37.33 C87.1 C81.1
  Top Layer w0.381: H20.2 58.57,50.48 58.57,46.23 57.81,45.46 ; 57.81,45.46 57.81,41.65 57.23,41.08 C83.2 ; 57.81,45.46 57.81,45.55 57.77,45.59 C95.1 ; C91.2 37.49,45.65 36.98,46.16 35.64,46.16 v1(34.76,47.05)
  Inner2 w0.508: v1(34.76,47.05) 34.82,47.12 54.19,47.12 57.56,50.48 H20.2
AVSS3: length 87.2
  Top Layer w0.254: U48.57 U48.58 29.78,45.31 C120.1 C119.1 ; C106.1 11.84,36.31 11.2,36.96 11.2,39.94 C104.1 11.2,40.07 11.2,41.78 ; U48.53 27.88,42.81 28.53,42.16 28.53,41.34 29.17,40.7 C109.2 C108.1 ; U48.32 15.91,39.8 17.1,38.61 17.1,36.73 16.68,36.31 C107.1 ; 17.36,45.3 17.36,44.51 17.18,44.33 15.93,44.33 U48.25 ; 17.36,45.3 17.36,46.52 17.07,46.81 U48.20 ; 17.36,45.3 17.35,45.31 U48.23 13.35,45.31 C116.2 13.27,44.8 12.91,44.45 12.91,43.69 C115.2
  Top Layer w0.305: C115.2 12.98,43.24 12.47,42.73 11.64,42.73 11.26,42.35 11.26,41.85 11.2,41.78
  Top Layer w0.381: 6.69,47.24 7.96,47.24 9.48,45.72 9.48,42.42 9.96,41.94 11.04,41.94 11.2,41.78 ; C107.1 C112.1 C106.1 ; C108.1 32.15,40.7 34.3,42.85 v1(34.3,45.78) 32.02,45.78 C119.1
  Inner2 w0.508: 34.06,45.78 32.47,47.37 H23.2
AVSS4: length 85.8
  Top Layer w0.254: 24.4,20.15 24.4,19.14 ; 24.4,20.15 24.4,23.24 24.81,23.65 U53.32 ; 24.4,20.15 24.41,20.15 U53.25 ; 24.4,19.14 24.4,18.41 25.17,17.65 U53.20 ; 24.4,19.14 24.41,19.15 U53.23 27.35,19.15 28.26,18.24 C133.2 28.79,18.25 C132.2 28.79,20.63 28.85,20.7 30.44,20.7 30.76,21.02 C122.1 30.88,21.91 C121.1 ; C126.2 11.77,23.05 C125.1 12.91,22.99 14.25,21.65 U53.53 ; U53.58 U53.57 14.13,19.65 13.97,19.81 C137.1 C136.1
  Top Layer w0.305: C126.2 9.36,23.05 8.91,22.6 8.91,19.67 8.96,19.67 ; C129.1 C123.1 ; C124.1 28.19,27.52
  Top Layer w0.381: C121.1 30.88,24.51 31.52,25.14 31.52,26.8 30.8,27.52 C123.1 ; C136.1 9.1,19.81 7.83,18.54 7.83,15.68 7.58,15.43 H26.2 ; C122.1 v1(32.16,21.78)
  Inner2 w0.508: H26.2 25.81,15.43 v1(32.16,21.78)
DVDD: length 197
  Top Layer w0.254: U1.48 43.17,26.58 41.23,28.51 v1(40.19,28.51) ; U1.52 42.34,22.13 42.63,22.41 42.63,22.92 42.42,23.13 U1.50 40.33,23.13 40.22,23.24 40.22,25.02 ; 43.17,25.36 43.14,25.33 43.14,24.26 43.39,24 49.36,24 49.67,24.31 49.67,25.36
  Top Layer w0.381: C15.1 68.98,56.29 U3.1 68.98,55.56 68.66,55.24 67.46,55.24 67.08,55.62 U3.3 65.96,56.29 65.05,55.37 65.05,47.24 66.38,45.91 73.3,45.91 73.68,45.53 H14.3 73.68,43.05 70.57,39.94 H19.1 ; v1(40.19,28.51) C143.2 40.19,25.05 C142.2
  Inner2 w0.508: H12.5 74.44,23.3 76.22,25.08 80.98,25.08 81.49,25.59 81.49,39.3 80.48,40.32 77.17,40.32 73.62,43.88 H14.3 ; H25.1 6.24,26.29 6.24,36.19 6.69,36.64 8.05,36.64 10.89,39.48 59.7,39.48 H19.1 60.16,37.21 56.64,33.7 56.64,28.43 53.55,25.33 43.36,25.33 v1(40.19,28.51)
DVDD2: length 23.7
  Top Layer w0.254: U32.35 43.64,39.95 43.82,40.13 49.89,40.13 50.14,39.88 U32.48 52.47,38.86 52.92,39.31 C145.2 ; C145.2 C144.2 ; C145.2 53.93,40.32 53.09,41.16 U32.50
  Top Layer w0.381: H19.2 56.98,39.31 C144.2
DVDD3: length 36.1
  Top Layer w0.254: C146.2 C147.2 28.34,38.93 28.34,40.77 27.79,41.31 U48.50 ; U48.48 25.21,39.9 24.66,40.45 19.07,40.45 18.71,40.09 U48.35
  Top Layer w0.305: H22.2 6.74,39.13 8.9,39.13 9.16,38.86 9.16,37.53 12.59,34.1 16.28,34.1 18.71,36.53 U48.35
  Top Layer w0.381: 28.47,38.8 27.26,38.8 27.05,39.01 U48.48
DVDD4: length 29.6
  Top Layer w0.254: U53.50 14.27,23.15 14.12,23.3 14.12,24.83 C149.2 C148.2 16.79,26.8 17.09,26.49 U53.48 17.09,24.39 17.34,24.14 23.39,24.14 23.59,24.34 U53.35
  Top Layer w0.381: 14.24,26.8 14.24,28.26 13.78,28.72 12.36,28.72 7.45,23.81 6.31,23.81 H25.2
PGND: length 21.1
  Top Layer w0.254: v2(79.84,48.33) C10.2 78.49,48.12 U22.1 ; H12.6 v2(76.98,19.75) ; v2(72.29,55.05) C18.2 C19.2 ; U3.2 68.03,56.83 67.58,57.28 C15.2 ; C13.2 v2(77.11,51.88) ; v2(69.49,49.53) C11.2 C12.2 ; R57.2 v2(78.89,19.05) ; C56.1 C54.1 v2(80.16,56.45) ; U21.4 v2(73.91,55.81) ; 67.58,58.29 v2(67.58,59.69)
  vias: v3(67.71,63.16) v3(67.71,47.92) v3(67.71,32.68) v3(67.71,27.6) v3(72.79,63.16) v3(72.79,58.08) v3(72.79,53) v3(72.79,27.6) v3(77.87,63.16) v3(77.87,58.08) v3(77.87,47.92) v3(77.87,42.84) v3(77.87,27.6) v3(82.95,63.16) v3(82.95,58.08) v3(82.95,53) v3(82.95,47.92) v3(82.95,42.84)
BIAS: length 15.2
  Top Layer w0.254: C57.2 38.25,11.17 37.95,10.87 R11.2 ; C57.2 40.02,11.17 40.24,11.39 40.24,16.38 40.49,16.63 U1.63 U1.62 ; C57.2 39.26,10.48 39.64,10.09 40.92,10.09 42.06,8.95 R2.1
BIASINV: length 108.1
  Top Layer w0.254: U1.61 40.45,17.63 39.77,16.95 39.77,13.91 39.26,13.4 C57.1 37.15,12.57 R11.1 36.85,12.89 36.79,12.95 35.07,12.95 33.93,14.1 v3(33.93,14.22) v2(33.93,30.03) ; v3(33.42,50.47) 29.16,50.47 28.28,49.59 28.28,47.12 27.98,46.81 U48.61 ; U53.61 14.37,17.65 13.99,17.27 v3(13.99,14.22) ; U32.61 52.72,46.66 53.07,47.01 53.07,50.42 v3(53.01,50.48)
  Bottom Layer w0.254: v2(33.93,30.03) 34.95,31.05 34.95,34.42 33.36,36 33.36,50.41 v3(33.42,50.47) 33.43,50.48 v3(53.01,50.48) ; v3(13.99,14.22) v3(33.93,14.22)
CLK: length 54.5
  Top Layer w0.254: U53.37 22.59,31.52 22.94,31.88 22.94,34.42 ; U48.37 19.71,35.36 20.66,34.42 22.94,34.42 ; 22.94,34.42 34.12,34.42 34.35,34.65 44.39,34.65 44.64,34.9 ; 44.64,34.9 U32.37 ; 44.64,34.9 44.65,34.89 49.83,34.89 50.57,34.16 50.57,31.05 50.04,30.53 R48.1
CS1: length 38.2
  Top Layer w0.254: U1.39 47.67,26.7 v2(47.68,26.72) ; v5(54.89,30.67) 62.7,30.67 H13.5
  Bottom Layer w0.254: v5(54.89,30.67) 54.89,29.72 54.09,28.92 45.65,28.92 45.42,29.14 43.52,29.14 43,28.63 43,27.44 43.73,26.72 v2(47.68,26.72)
CS2: length 73.7
  Top Layer w0.254: U32.39 v3(45.64,37.65) ; H13.4 71.9,38.67 71.39,39.18 63.2,39.18 60.41,36.38 49.55,36.38 v3(48.41,37.53) ; v3(20.72,37.46) 20.71,37.47 U48.39 ; v3(31.68,38.1) v3(34.33,38.1) ; U53.39 v2(21.59,30.1)
  Bottom Layer w0.254: v3(48.41,37.53) 48.28,37.65 v3(45.64,37.65) 45.19,38.1 v3(34.33,38.1) ; 23.9,38.1 21.36,38.1 v3(20.72,37.46) ; 23.9,38.1 v3(31.68,38.1) ; 23.9,38.1 23.9,35.94 25.42,34.42 25.42,31.94 23.58,30.1 v2(21.59,30.1)
DAISY_IN1: length 8.4
  Top Layer w0.254: U1.41 46.63,25.47 46.63,26.35 45.32,27.66 45.32,30.03 46.82,31.53 46.82,32.64
DAISY_IN2: length 18.4
  Top Layer w0.254: v2(46.63,34.35) 46.45,34.17 34.45,34.17 33.61,33.34 H16.2 ; U32.41 46.65,38.85 v2(46.65,35.5)
  Bottom Layer w0.254: v2(46.63,34.35) 46.63,35.47 v2(46.65,35.5)
DAISY_IN3: length 6.2
  Top Layer w0.254: v2(21.74,34.92) 21.71,34.95 U48.41
  Bottom Layer w0.254: H17.2 21.74,32.89 v2(21.74,34.92)
DOUT1: length 8.9
  Top Layer w0.254: 44.28,32.64 44.28,33.46 44.58,33.77 46.8,33.77 v2(47.45,34.42) ; U32.43 v2(47.64,35.47)
  Bottom Layer w0.254: v2(47.45,34.42) 47.45,35.27 v2(47.64,35.47)
DOUT2: length 12.1
  Top Layer w0.254: U48.43 22.71,38.23 23.06,37.89 25.06,37.89 v3(25.67,37.27)
  Bottom Layer w0.254: v3(25.67,37.27) 25.67,35.94 28.72,32.89 H16.1
DOUT3: length 7.6
  Top Layer w0.254: 19.13,32.83 19.13,30.61 19.59,30.15 U53.43
DRDY: length 44.1
  Top Layer w0.254: 43.67,25.36 43.67,28.45 v3(43.66,28.46) ; H13.1 79.46,37.27 79.46,34.8 73.3,28.64 65.35,28.64 65.24,28.53 64.85,28.53 64.77,28.45 v2(55.46,28.45)
  Bottom Layer w0.254: 55.39,28.45 55.4,28.45 ; 55.4,28.45 55.39,28.44 55.38,28.46 v3(43.66,28.46) ; 55.4,28.45 v2(55.46,28.45)
EEG1: length 17.5
  Top Layer w0.254: v3(59.52,4.95) 59.52,7.75 58.95,8.32 U16.2 ; H7.2 56.28,2.79 56.28,4 55.33,4.95 51.14,4.95 50.38,5.71 50.38,6.72
  Bottom Layer w0.254: v3(59.52,4.95) 58.44,4.95 H7.2
EEG2: length 15.2
  Top Layer w0.254: H7.3 53.68,4.19 53.42,4.44 50.25,4.44 49.58,5.12 49.58,6.72 ; v3(55.01,7.76) 55.01,7.94 56.04,8.97 U16.4
  Bottom Layer w0.254: H7.3 55.01,4.06 v3(55.01,7.76)
EEG3: length 13.7
  Top Layer w0.254: U16.5 56.29,8.32 54.5,6.54 v3(54.5,5.9) ; 48.78,6.72 48.78,5.01 49.89,3.9 50.95,3.9 51.13,3.72 51.13,2.74 H7.4
  Bottom Layer w0.254: H7.4 54.31,5.9 v3(54.5,5.9)
EEG4: length 11.9
  Top Layer w0.254: 47.98,6.72 47.98,4.62 48.6,4 H7.5 ; U17.2 v3(53.3,6.28)
  Bottom Layer w0.254: H7.5 50.5,4.63 52.15,4.63 53.3,5.78 v3(53.3,6.28)
EEG5: length 13.4
  Top Layer w0.254: U17.1 v3(52.65,6.48) ; 46.44,6.72 46.44,4.38 46.06,4 H7.6
  Bottom Layer w0.254: v3(52.65,6.48) 52.65,6.27 51.65,5.27 48.6,5.27 H7.6
EEG6: length 11.9
  Top Layer w0.254: 45.64,6.72 45.64,5.04 44.53,3.94 43.71,3.94 43.45,3.68 43.45,2.79 H7.7 ; U11.4 v3(40.66,6.84)
  Bottom Layer w0.254: H7.7 42.69,2.73 40.66,4.76 v3(40.66,6.84)
EEG7: length 15.4
  Top Layer w0.254: U11.2 37.3,7.49 36.91,7.11 v3(36.91,6.73) ; H7.8 41.11,2.86 41.11,4.25 41.36,4.51 43.9,4.51 44.85,5.46 44.85,6.55
  Bottom Layer w0.254: H7.8 39.64,4.06 38.06,4.06 36.91,5.21 v3(36.91,6.73)
EEG8: length 16.3
  Top Layer w0.254: U11.1 37.25,8.14 36.15,7.05 v3(36.15,6.67) ; H7.9 38.57,2.86 38.57,4.38 39.14,4.95 43.33,4.95 43.97,5.59 43.97,6.46
  Bottom Layer w0.254: H7.9 36.15,5.01 v3(36.15,6.67)
EEG9: length 14.6
  Top Layer w0.254: U39.1 v3(39.19,55.31) ; H8.8 37.23,60.39 37.8,59.82 v3(38.12,59.82) 41.8,59.82 42.76,58.86 42.76,58.24
  Bottom Layer w0.254: v3(39.19,55.31) 38.12,56.37 v3(38.12,59.82)
EEG10: length 16.7
  Top Layer w0.254: v3(39.2,59.31) 38.57,59.31 37.87,58.61 37.87,55.37 38.5,54.74 39.39,54.74 39.84,55.18 U39.2 ; 43.56,58.24 43.56,59.14 42.38,60.32 40.28,60.32 39.77,60.83 H8.7
  Bottom Layer w0.254: v3(39.2,59.31) v3(40.21,60.31)
EEG11: length 10.1
  Top Layer w0.254: RN18.6 44.36,58.27 44.36,59.48 v3(44.28,59.56) 43.01,60.83 42.5,60.83 42.31,61.02 H8.6 ; U39.4 v3(40.49,58.74)
  Bottom Layer w0.254: v3(44.28,59.56) 41.31,59.56 v3(40.49,58.74)
EEG12: length 11
  Top Layer w0.254: U39.5 39.84,58.99 v3(40.18,59.33) ; H8.5 44.85,60.32 45.16,60.01 45.16,58.24
  Bottom Layer w0.254: v3(40.18,59.33) 40.92,60.07 v3(45.17,60.07)
EEG13: length 10.9
  Top Layer w0.254: H8.4 47.39,60.64 46.76,60.01 46.76,58.24 ; U37.5 v3(52.15,58.8)
  Bottom Layer w0.254: v3(46.76,59.69) 51.27,59.69 v3(52.15,58.8)
EEG14: length 12
  Top Layer w0.254: U37.4 v3(52.8,58.86) ; 47.56,58.24 47.56,59.73 v3(48.03,60.2) 48.34,60.51 49.68,60.51 49.86,60.69 49.86,62.22 H8.3
  Bottom Layer w0.254: v3(48.03,60.2) 51.47,60.2 v3(52.8,58.86)
EEG15: length 15.4
  Top Layer w0.254: H8.2 52.47,60.45 52.09,60.07 49.42,60.07 48.36,59.01 48.36,58.24 ; v3(53.79,58.67) 53.79,55.74 53.17,55.12 52.41,55.12 52.15,55.37 U37.2
  Bottom Layer w0.254: v3(52.22,60.2) 52.27,60.2 v3(53.79,58.67)
EEG16: length 18.3
  Top Layer w0.254: U37.1 51.5,55.39 52.34,54.55 53.93,54.55 54.69,55.31 54.69,58.77 53.76,59.71 ; H8.1 55.01,60.96 53.76,59.71 ; 53.76,59.71 53.55,59.5 49.68,59.5 49.16,58.98 49.16,58.24
EEG17: length 11.4
  Top Layer w0.254: 17.55,58.75 17.6,58.75 17.6,59.45 16.88,60.16 13.2,60.16 12.21,61.15 12.21,62.23 H9.8 ; U59.1 13.29,58.29 v3(12.53,58.29)
  Bottom Layer w0.254: v3(13.86,60.2) 12.53,58.86 v3(12.53,58.29)
EEG18: length 13.6
  Top Layer w0.254: U59.2 12.34,57.53 11.9,57.97 11.9,58.67 12.85,59.62 v3(14.63,59.62) ; H9.7 14.69,61.02 15.07,60.64 v3(15.96,60.64) 17.17,60.64 18.37,59.43 18.37,58.75 18.35,58.75
  Bottom Layer w0.254: v3(14.63,59.62) 15.64,60.64 v3(15.96,60.64)
EEG19: length 11.1
  Top Layer w0.254: v3(16.47,59.12) 16.47,57.66 15.69,56.88 U59.4 ; RN20.6 19.15,58.58 19.15,59.99 18.25,60.89 17.55,60.89 17.29,61.15 17.29,62.23 H9.6
  Bottom Layer w0.254: v3(19.13,59.82) 17.17,59.82 v3(16.47,59.12)
EEG20: length 10.9
  Top Layer w0.254: U59.5 15.58,57.53 15.96,57.91 15.96,59.43 v3(15.9,59.5) ; H9.5 19.77,60.64 19.95,60.46 19.95,58.58 RN20.5
  Bottom Layer w0.254: v3(15.9,59.5) 16.85,60.45 v3(19.9,60.45)
EEG21: length 9.9
  Top Layer w0.254: U58.5 26.37,57.91 25.55,58.74 v3(25.55,59.62) ; H9.4 22.31,60.96 21.99,60.64 v3(21.99,59.82) 21.99,58.81 22,58.81
  Bottom Layer w0.254: v3(25.55,59.62) 25.36,59.82 v3(21.99,59.82)
EEG22: length 9.9
  Top Layer w0.254: 22.8,58.81 22.77,58.81 22.77,60.02 23.86,61.11 24.62,61.11 24.85,61.34 H9.3 ; U58.4 26.49,58.56 26.26,58.79 v3(26.26,59.56)
  Bottom Layer w0.254: v3(26.26,59.56) 26.26,59.68 25.55,60.39 v3(23.2,60.39)
EEG23: length 12.9
  Top Layer w0.254: H9.2 27.39,61.59 26.5,60.7 24.79,60.7 23.6,59.52 RN21.6 ; v3(27.2,59.62) 29.48,59.62 30.06,59.05 30.06,58.48 29.48,57.91 U58.2
  Bottom Layer w0.254: v3(27.2,59.62) v3(26.16,60.66)
EEG24: length 13.2
  Top Layer w0.254: RN21.5 24.4,59.36 25.22,60.18 28.52,60.18 29.03,60.69 ; 29.03,60.69 30.56,59.16 30.56,58.16 29.66,57.26 U58.1 ; 29.03,60.69 29.93,61.59 H9.1
EEG25: length 10.6
  Top Layer w0.254: H10.8 29.68,2.92 29.68,4.13 28.69,5.11 24.81,5.11 24.18,5.74 24.18,6.21 ; U61.1 29.56,6.71 29.68,6.6 29.68,5.97 28.85,5.14
EEG26: length 13.3
  Top Layer w0.254: v3(30.18,5.14) 30.18,6.98 29.8,7.36 U61.2 ; H10.7 27.2,2.86 v3(27.2,4.57) 24.15,4.57 23.38,5.34 23.38,6.21
  Bottom Layer w0.254: v3(27.2,4.57) 29.61,4.57 v3(30.18,5.14)
EEG27: length 11.3
  Top Layer w0.254: H10.6 24.72,3.81 24.39,4.14 23.69,4.14 22.58,5.25 22.58,6.21 ; v3(25.61,5.59) 25.61,7.05 26.58,8.01 U61.4
  Bottom Layer w0.254: v3(22.69,5.14) 25.17,5.14 v3(25.61,5.59)
EEG28: length 10.9
  Top Layer w0.254: U61.5 26.56,7.36 26.25,7.05 v3(26.25,5.59) ; H10.5 22.21,2.82 v3(22.21,4.6) 21.78,5.04 21.78,6.21
  Bottom Layer w0.254: v3(22.21,4.6) 25.71,4.6 26.25,5.14 v3(26.25,5.59)
EEG29: length 10.6
  Top Layer w0.254: H10.4 v3(19.64,4.7) 19.92,4.98 19.92,6.21 ; U60.5 14.12,6.03 14.24,5.9 v3(15.26,5.9)
  Bottom Layer w0.254: v3(19.64,4.7) 19.2,5.14 16.02,5.14 v3(15.26,5.9)
EEG30: length 10.6
  Top Layer w0.254: H10.3 17.1,4.06 17.11,4.07 v3(17.11,4.38) 18.5,4.38 19.12,5 19.12,6.21 ; v3(13.4,5.9) 13.4,6.97 U60.4
  Bottom Layer w0.254: v3(13.4,5.9) 14.58,5.9 16.11,4.38 v3(17.11,4.38)
EEG31: length 16.2
  Top Layer w0.254: H10.2 14.56,4.06 v3(15.02,4.52) 15.39,4.89 17.86,4.89 18.32,5.35 18.32,6.21 ; U60.2 14.12,9.59 13.8,9.9 12.66,9.9 12.4,9.65 v3(12.4,6.09)
  Bottom Layer w0.254: v3(12.4,6.09) 12.47,6.09 13.23,5.33 14.37,5.33 15.02,4.69 v3(15.02,4.52)
EEG32: length 17.9
  Top Layer w0.254: 12.5,4.92 13,5.43 17.26,5.43 17.52,5.69 17.52,6.21 ; 12.5,4.92 12.02,4.44 H10.1 ; 12.5,4.92 11.58,5.84 11.58,9.46 12.53,10.41 13.93,10.41 14.77,9.57 U60.1
IN1P: length 7.2
  Top Layer w0.254: RN17.1 50.43,8.75 50.44,8.76 v3(50.44,9.27) 50.5,9.33 C151.4 ; 50.67,14.26 v3(50.67,13.02)
  Bottom Layer w0.254: v3(50.67,13.02) 50.67,9.5 v3(50.44,9.27)
IN2P: length 7.1
  Top Layer w0.254: RN17.2 49.63,9.27 v3(49.64,9.27) 49.7,9.33 C151.3 ; 49.67,14.26 49.68,14.25 v3(49.68,12.95)
  Bottom Layer w0.254: v3(49.64,9.27) 49.68,9.31 v3(49.68,12.95)
IN3P: length 7.1
  Top Layer w0.254: 48.67,14.26 48.67,13.02 v3(48.66,13.02) ; 48.8,8.26 48.8,9.22 v3(48.84,9.26) 48.9,9.32 C151.2
  Bottom Layer w0.254: v3(48.84,9.26) 48.84,12.84 v3(48.66,13.02)
IN4P: length 7.2
  Top Layer w0.254: C151.1 48.1,9.3 v3(48.08,9.28) 48.03,9.23 RN17.4 ; 47.67,14.26 v3(47.67,13.02)
  Bottom Layer w0.254: v3(47.67,13.02) 48.08,12.6 v3(48.08,9.28)
IN5P: length 7.3
  Top Layer w0.254: 46.67,14.26 v3(46.67,12.95) ; 46.46,10.28 v3(46.46,9.23) 46.44,9.21 46.44,8.17 RN16.1
  Bottom Layer w0.254: v3(46.46,9.23) 46.67,9.43 v3(46.67,12.95)
IN6P: length 7.1
  Top Layer w0.254: 45.67,14.26 v3(45.67,13.02) ; RN16.2 45.64,8.17 v3(45.64,9.25) 45.64,10.27
  Bottom Layer w0.254: v3(45.67,13.02) 45.67,9.28 v3(45.64,9.25)
IN7P: length 7.3
  Top Layer w0.254: 44.84,10.27 44.9,10.21 v3(44.9,9.27) 44.9,8.23 RN16.3 ; 44.67,14.26 v3(44.67,13.02)
  Bottom Layer w0.254: v3(44.67,13.02) 44.67,9.51 v3(44.9,9.27)
IN8P: length 7.3
  Top Layer w0.254: 43.67,14.26 v3(43.67,13.02) ; RN16.4 44.03,9.26 v3(44.03,9.27) 44.03,9.28 C150.5
  Bottom Layer w0.254: v3(44.03,9.27) 44.03,12.66 v3(43.67,13.02)
IN9P: length 7.7
  Top Layer w0.254: C152.8 42.64,54.36 42.69,54.42 v3(42.69,55.31) 42.76,55.38 42.76,56.54 RN18.1 ; U32.16 v3(42.64,51.31)
  Bottom Layer w0.254: v3(42.69,55.31) 42.64,55.25 v3(42.64,51.31)
IN10P: length 7.8
  Top Layer w0.254: RN18.2 43.56,56.54 v3(43.56,55.29) 43.43,55.16 43.43,54.21 ; v3(43.65,51.24) 43.65,49.97 U32.14
  Bottom Layer w0.254: v3(43.65,51.24) 43.65,55.21 v3(43.56,55.29)
IN11P: length 8
  Top Layer w0.254: 44.23,54.21 44.28,54.26 v3(44.28,55.37) 44.36,55.45 44.36,56.54 RN18.3 ; U32.12 v3(44.64,51.24)
  Bottom Layer w0.254: v3(44.64,51.24) 44.28,51.6 v3(44.28,55.37)
IN12P: length 8
  Top Layer w0.254: 45.1,54.29 C152.5 ; 45.1,54.29 v3(45.1,55.34) RN18.4 ; 45.1,54.29 45.1,54.29 ; U32.10 45.68,50 v3(45.68,51.24)
  Bottom Layer w0.254: v3(45.1,55.34) 45.68,54.76 v3(45.68,51.24)
IN13P: length 7.8
  Top Layer w0.254: U32.8 46.69,50.01 v3(46.69,51.18) ; RN19.1 46.76,56.48 v3(46.76,55.35) 46.8,55.31 46.8,54.24
  Bottom Layer w0.254: v3(46.69,51.18) 46.69,55.28 v3(46.76,55.35)
IN14P: length 7.8
  Top Layer w0.254: v3(47.58,51.31) 47.64,51.25 U32.6 ; C153.3 47.68,54.29 47.69,54.3 v3(47.69,55.26) 47.56,55.39 47.56,56.48 RN19.2
  Bottom Layer w0.254: v3(47.69,55.26) 47.69,51.41 v3(47.58,51.31)
IN15P: length 7.8
  Top Layer w0.254: U32.4 v3(48.64,51.31) ; C153.2 48.44,54.29 48.47,54.32 v3(48.47,55.37) 48.36,55.48 48.36,56.48 RN19.3
  Bottom Layer w0.254: v3(48.64,51.31) 48.64,55.2 v3(48.47,55.37)
IN16P: length 7.8
  Top Layer w0.254: v3(49.68,51.31) 49.64,51.27 U32.2 ; RN19.4 49.16,56.48 49.16,55.38 v3(49.27,55.27) 49.27,54.33 C153.1
  Bottom Layer w0.254: v3(49.68,51.31) 49.68,54.86 v3(49.27,55.27)
IN17P: length 8.2
  Top Layer w0.254: C154.8 17.55,54.65 v3(17.55,55.82) 17.55,56.95 ; v3(17.74,51.56) 17.74,50.14 17.71,50.11
  Bottom Layer w0.254: v3(17.55,55.82) 17.55,51.74 v3(17.74,51.56)
IN18P: length 8.1
  Top Layer w0.254: 18.35,54.71 v3(18.35,55.84) 18.35,56.95 ; 18.71,50.11 v3(18.71,51.5)
  Bottom Layer w0.254: v3(18.71,51.5) 18.35,51.86 v3(18.35,55.84)
IN19P: length 8.1
  Top Layer w0.254: 19.71,50.11 v3(19.71,51.5) ; 19.15,56.95 v3(19.15,55.79) 19.15,54.71
  Bottom Layer w0.254: v3(19.71,51.5) 19.15,52.05 v3(19.15,55.79)
IN20P: length 8.1
  Top Layer w0.254: 20.71,50.11 v3(20.71,51.43) ; 19.95,54.86 v3(19.95,55.81) 19.95,56.95
  Bottom Layer w0.254: v3(20.71,51.43) 19.95,52.19 v3(19.95,55.81)
IN21P: length 8.1
  Top Layer w0.254: 21.71,50.11 v3(21.71,51.5) ; 22,57.01 22,56.01 v3(21.89,55.9) 21.93,55.86 C155.4
  Bottom Layer w0.254: v3(21.71,51.5) 21.89,51.67 v3(21.89,55.9)
IN22P: length 7.9
  Top Layer w0.254: 22.71,50.11 v3(22.71,51.43) ; 22.8,57.01 v3(22.8,55.78) 22.8,54.93 C155.3
  Bottom Layer w0.254: v3(22.8,55.78) 22.8,51.52 v3(22.71,51.43)
IN23P: length 8.1
  Top Layer w0.254: 23.6,54.8 23.6,54.58 ; 23.71,50.11 v3(23.71,51.5) ; 23.6,57.01 v3(23.6,55.79) 23.6,54.93 C155.2
  Bottom Layer w0.254: v3(23.71,51.5) 23.6,51.61 v3(23.6,55.79)
IN24P: length 8.2
  Top Layer w0.254: 24.4,57.01 v3(24.4,55.82) 24.4,54.8 ; v3(24.72,51.5) 24.72,50.12 24.71,50.11 ; 24.4,54.8 C155.1 ; 24.4,54.8 24.4,54.73
  Bottom Layer w0.254: v3(24.4,55.82) 24.72,55.5 v3(24.72,51.5)
IN25P: length 8.1
  Top Layer w0.254: RN22.1 24.24,7.81 v3(24.24,8.98) 24.26,9 24.26,10.21 C156.8 ; U53.16 24.6,14.34 v3(24.6,13.02)
  Bottom Layer w0.254: v3(24.6,13.02) 24.6,11.87 24.15,11.43 24.15,9.07 v3(24.24,8.98)
IN26P: length 7.9
  Top Layer w0.254: U53.14 v3(23.59,13.02) ; RN22.2 23.47,9.04 v3(23.44,9.07) 23.54,9.16 23.54,10.21
  Bottom Layer w0.254: v3(23.44,9.07) 23.39,9.12 23.39,11.24 23.59,11.44 v3(23.59,13.02)
IN27P: length 7.8
  Top Layer w0.254: v3(22.63,12.95) 22.63,14.31 U53.12 ; 22.73,10.21 22.7,10.18 v3(22.7,9.02) 22.7,7.78 RN22.3
  Bottom Layer w0.254: v3(22.63,12.95) 22.63,9.1 v3(22.7,9.02)
IN28P: length 7.9
  Top Layer w0.254: RN22.4 21.87,7.97 21.91,8.01 v3(21.91,9.05) 21.91,10.21 ; U53.10 v3(21.59,13.08)
  Bottom Layer w0.254: v3(21.59,13.08) 21.59,11.45 21.91,11.13 v3(21.91,9.05)
IN29P: length 8
  Top Layer w0.254: U53.8 v3(20.59,13.02) ; RN23.1 19.92,7.85 19.91,7.86 v3(19.91,9.13) 19.91,10.21 19.98,10.21
  Bottom Layer w0.254: v3(19.91,9.13) 19.96,9.18 19.96,11.11 20.59,11.74 v3(20.59,13.02)
IN30P: length 7.9
  Top Layer w0.254: U53.6 v3(19.59,13.02) ; 19.03,10.21 19.08,10.21 19.09,10.2 v3(19.09,9.11) 19.09,7.91 RN23.2
  Bottom Layer w0.254: v3(19.59,13.02) 19.59,11.69 19.09,11.19 v3(19.09,9.11)
IN31P: length 7.9
  Top Layer w0.254: v3(18.56,13.02) 18.59,13.04 U53.4 ; RN23.3 18.35,7.92 18.29,7.98 v3(18.29,9.14) 18.29,10.21 18.23,10.21
  Bottom Layer w0.254: v3(18.56,13.02) 18.56,11.68 18.18,11.3 18.18,9.25 v3(18.29,9.14)
IN32P: length 7.6
  Top Layer w0.254: 17.48,10.21 v3(17.48,9.21) 17.48,7.97 17.55,7.9 RN23.4 ; U53.2 v3(17.59,13.02)
  Bottom Layer w0.254: v3(17.59,13.02) 17.59,11.41 17.48,11.3 v3(17.48,9.21)
MISO: length 30.1
  Top Layer w0.254: 45.67,25.36 45.67,26.21 44.73,27.15 v3(44.73,27.94) ; v2(58.63,27.81) 63.39,27.81 H12.3
  Bottom Layer w0.254: v2(58.63,27.81) 58.5,27.94 v3(44.73,27.94)
MOSI: length 91.8
  Top Layer w0.254: v4(65.05,27.81) 65.93,27.81 H12.4 ; U53.34 v2(24.09,27.88) ; U32.34 v3(43.14,37.08) ; 50.17,25.36 v3(50.17,26.59) 50.19,26.61 51.33,26.61 51.84,27.11 51.84,28.57 52.66,29.4 v3(53.68,29.4) 64.65,29.4 v3(65.05,29.01) ; U48.34 18.21,36.98 v3(18.12,36.89) ; v2(23.06,36.7) v3(34.35,36.7)
  Bottom Layer w0.254: v2(24.09,27.88) 19.96,27.88 17.36,30.48 17.36,36.13 v3(18.12,36.89) 18.17,36.94 22.62,36.94 22.85,36.7 v2(23.06,36.7) ; v3(65.05,29.01) v4(65.05,27.81) ; v3(34.35,36.7) 42.76,36.7 v3(43.14,37.08) 47.77,37.08 47.92,36.93 51.42,36.93 53.68,34.67 v3(53.68,29.4)
RESET: length 93.7
  Top Layer w0.254: v2(23.26,36.07) 23.33,36.13 41.93,36.13 42.19,36.39 v2(44.14,36.39) U32.36 ; H13.2 69.62,29.97 v3(52.28,29.97) 51.96,29.97 51.39,29.4 51.39,27.55 50.95,27.11 49.74,27.11 v3(49.17,26.54) 49.17,25.37 49.17,25.36 ; U48.36 19.21,36.35 v3(19.22,36.34) ; U53.36 v2(23.09,28.76)
  Bottom Layer w0.254: v2(44.14,36.39) 44.27,36.52 49.86,36.52 52.28,34.1 v3(52.28,29.97) ; v2(23.26,36.07) 22.88,36.07 22.44,36.51 19.39,36.51 v3(19.22,36.34) 17.93,35.05 17.93,30.8 19.96,28.76 v2(23.09,28.76)
RL: length 11.9
  Top Layer w0.254: H7.10 35.9,4.44 36.81,5.36 41.64,5.36 42.06,5.78 R2.2 41.35,6.8 41.17,6.97 41.17,7.17 40.85,7.49 U11.5
SCLK: length 77.2
  Top Layer w0.254: U32.40 46.14,35.56 v2(46.05,35.47) ; v2(21.17,35.4) 21.2,35.43 21.2,37.66 21.17,37.69 21.17,38.97 U48.40 ; v2(43.52,35.34) 43.26,35.08 34.02,35.08 33.86,34.92 v2(22.69,34.92) ; H12.2 66.82,22.92 62.63,27.11 v2(59.33,27.11) ; U53.40 v2(21.09,30.92) ; v3(46.25,29.78) 46.16,29.69 46.16,27.86 v3(46.56,27.45) 47.17,26.84 47.17,25.36
  Bottom Layer w0.254: v3(46.25,29.78) 45.61,30.41 45.61,33.46 46.05,33.9 v2(46.05,35.47) 46.01,35.43 43.61,35.43 v2(43.52,35.34) ; v2(21.09,30.92) 21.74,30.92 22.82,32 22.82,34.8 v2(22.69,34.92) 22.41,34.92 21.94,35.4 v2(21.17,35.4) ; v3(46.56,27.45) 46.68,27.33 59.11,27.33 v2(59.33,27.11)
SRB: length 141.4
  Top Layer w0.254: R56.1 28.09,12.21 R52.1 ; v3(32.91,29.72) 33.23,29.4 33.23,15.49 v3(30.54,12.8) 29.97,12.23 R52.1 ; 54,12.56 54,10.73 59.58,10.73 v2(60.09,10.22) 61.99,10.22 ; 54,12.56 v3(55.33,12.56) ; 54,12.56 54,13.27 52.54,14.73 52.54,16.06 U1.17 ; H7.1 58.95,2.92 v2(58.95,6.12) 58.95,7.36 58.65,7.67 U16.1 ; U53.17 27.33,15.21 27.33,13.84 28.07,13.1 R52.1 ; 14.09,51.14 14.05,51.18 v3(12.66,51.18) ; 14.09,51.14 R41.1 14.31,50.92 14.31,50.04 14.44,49.91 14.94,49.91 15.91,48.94 U48.17 ; 14.09,51.14 R54.1 ; v3(26.56,51.43) 27.67,52.54 R33.1 R36.1 38.97,49.91 39.54,49.34 39.9,49.34 40.84,48.4 U32.17
  Bottom Layer w0.254: v2(58.95,6.12) 58.98,6.09 59.27,6.09 60.09,6.92 v2(60.09,10.22) ; v3(26.56,51.43) 25.93,50.8 13.04,50.8 v3(12.66,51.18) ; v3(32.47,52.51) 32.48,52.5 32.48,30.15 v3(32.91,29.72) ; v3(30.54,12.8) 42.78,12.8 43.47,13.5 54.39,13.5 v3(55.33,12.56)
START: length 87
  Top Layer w0.254: U1.38 48.17,26.91 47.84,27.24 47.37,27.24 47.23,27.39 47.23,29.42 v3(48.15,30.35) ; v2(51.01,30.35) 55.96,35.3 v2(66.12,35.3) ; U48.38 v2(20.21,35.94) ; U53.38 22.09,29.39 v2(22.08,29.4) ; v2(43.77,35.91) 42.73,35.91 42.38,35.56 v2(22.82,35.56) ; U32.38 45.14,35.94 v2(45.14,35.94)
  Bottom Layer w0.254: v2(66.12,35.3) 72.41,35.3 H13.3 ; v2(22.08,29.4) 21.36,29.4 20.53,30.22 20.53,34.67 20.15,35.05 20.15,35.88 v2(20.21,35.94) 22.44,35.94 v2(22.82,35.56) ; v2(43.77,35.91) 45.11,35.91 v2(45.14,35.94) 45.21,36 48.03,36 48.41,35.62 48.41,34.48 48.15,34.22 v3(48.15,30.35) v2(51.01,30.35)
$1N3003: length 6
  Top Layer w0.254: C39.2 C38.2 55.65,21.59 53.69,19.63 U1.24
$1N3116: length 8.7
  Top Layer w0.254: 57.3,25.84 57.3,24.82 57.04,24.56 55.83,24.56 54.89,23.62 54.89,21.72 53.8,20.63 U1.26
$1N3286: length 6.2
  Top Layer w0.254: U1.28 53.78,21.63 54.31,22.16 54.31,23.87 55.46,25.02 C86.2
$1N3353: length 4.1
  Top Layer w0.254: 53.68,25.71 53.68,22.92 53.38,22.63 U1.30
$1N5373: length 5.6
  Top Layer w0.254: U1.55 41.38,20.64 39.9,20.64 38.89,21.64 C45.2 C46.1
$1N33196: length 1.9
  Top Layer w0.254: U22.4 74.44,50.07 C13.1
$1N37296: length 2.1
  Top Layer w0.254: U21.3 76.88,56.43 76.54,56.77 C55.2
$1N37302: length 6.2
  Top Layer w0.254: C55.1 75.14,56.83 74.95,56.64 74,56.64 73.43,56.07 73.43,54.29 73.87,53.85 74.61,53.85 U21.5
$1N55627: length 23.8
  Top Layer w0.254: 46.09,15.75 47.14,15.75 ; 46.09,15.75 46.17,15.67 46.17,14.26 ; 46.09,15.75 45.17,15.75 ; 47.14,15.75 48.21,15.75 ; 47.14,15.75 47.17,15.72 47.17,14.26 ; 45.17,15.75 45.17,14.27 45.17,14.26 ; 45.17,15.75 44.15,15.75 ; 44.15,15.75 44.17,15.72 44.17,14.26 ; 44.15,15.75 43.65,15.75 43.17,15.27 43.17,14.26 ; 50.17,14.26 50.17,15.74 50.16,15.75 ; 49.17,14.26 49.17,15.69 49.11,15.75 ; 50.16,15.75 49.11,15.75 ; 50.16,15.75 50.69,15.75 51.47,14.97 51.47,12.81 51.71,12.57 52.75,12.57 ; 49.11,15.75 48.21,15.75 ; 48.21,15.75 48.21,14.31 48.17,14.26
$1N55886: length 3.2
  Top Layer w0.254: 48.67,25.36 48.67,27.04 48.04,27.67 R48.2
$1N55909: length 9.1
  Top Layer w0.254: 44.03,11.94 44.09,11.88 51.51,11.88 52.66,10.73
$3N17: length 6.9
  Top Layer w0.254: C78.2 C77.2 37.04,41.91 39.79,44.66 U32.24
$3N19: length 7.9
  Top Layer w0.254: U32.26 39.62,43.66 38.25,42.28 38.25,40.26 37.49,39.5 36.91,39.5 36.22,38.8 C79.2
$3N21: length 5.8
  Top Layer w0.254: U32.28 39.7,42.66 38.82,41.78 38.82,39.43 C87.2
$3N22: length 4.2
  Top Layer w0.254: U32.30 39.97,41.66 39.45,41.15 39.45,40.07 39.84,39.69 C81.2
$3N37: length 5
  Top Layer w0.254: U32.55 52.88,43.66 53.99,42.55 C82.2 56.41,42.55 C83.1
$3N174: length 26
  Top Layer w0.254: U32.1 50.14,48.78 49.49,48.13 49.16,48.13 ; 49.16,48.13 49.14,48.16 U32.3 ; 49.16,48.13 48.19,48.13 ; U32.13 44.14,48.13 ; 43.14,48.13 45.18,48.13 ; 43.14,48.13 42.63,48.13 42.06,48.7 42.06,50.1 41.41,50.74 40.37,50.74 ; 43.14,48.13 U32.15 ; U32.11 45.14,48.17 45.18,48.13 ; 47.15,48.13 46.22,48.13 ; 47.15,48.13 48.19,48.13 ; 47.15,48.13 47.14,48.14 U32.7 ; 46.22,48.13 45.18,48.13 ; 46.22,48.13 46.14,48.22 U32.9 ; 48.19,48.13 48.14,48.18 U32.5
$3N360: length 9.2
  Top Layer w0.254: 40.37,52.54 42.35,52.54 42.48,52.67 46.77,52.67 46.8,52.7 49.5,52.7
$4N31: length 23
  Top Layer w0.254: R41.2 15.64,50.99 15.64,50.1 17.1,48.64 19.19,48.64 ; 22.21,50.11 22.21,48.64 ; 22.21,48.64 23.25,48.64 ; 22.21,48.64 21.21,48.64 ; 19.19,48.64 20.21,48.64 ; 19.19,48.64 19.21,48.66 19.21,50.11 ; 20.21,48.64 21.21,48.64 ; 20.21,48.64 20.21,50.11 ; 21.21,48.64 21.21,50.11 ; 24.21,48.64 24.21,48.64 24.21,50.11 ; 24.21,48.64 25.04,48.64 25.22,48.82 25.22,50.11 25.21,50.11 ; 24.21,48.64 23.25,48.64 ; 23.25,48.64 23.21,48.68 23.21,50.11 ; 18.21,50.11 18.21,48.64
$4N82: length 5.4
  Top Layer w0.254: C108.2 C109.1 29.36,42.1 29.1,42.35 29.1,42.61 27.9,43.81 U48.55
$4N96: length 5.7
  Top Layer w0.254: C107.2 16.22,38.67 14.78,40.1 14.78,41.59 15.01,41.81 U48.30
$4N97: length 6.4
  Top Layer w0.254: U48.28 15.02,42.81 14.18,41.97 14.18,37.89 C112.2
$4N99: length 8
  Top Layer w0.254: C106.2 12.44,38.26 13.61,39.43 13.61,42.35 15.07,43.81 U48.26
$4N101: length 6.8
  Top Layer w0.254: C104.2 12.6,40.07 12.6,41.78 12.85,42.04 12.85,42.25 13.99,43.39 13.99,43.88 14.93,44.81 U48.24
$4N153: length 8.9
  Top Layer w0.254: R54.2 15.57,53.08 C154.1 C154.2 C154.3 C154.4 20.08,53.21 C155.5 C155.6 C155.7 C155.8
$5N129: length 6
  Top Layer w0.254: C121.2 29.48,21.91 C122.2 28.85,21.78 28.16,21.09 28.16,20.52 27.29,19.65 U53.24
$5N131: length 8.3
  Top Layer w0.254: 29.96,25.97 C123.2 30.12,26.11 30.12,25.02 29.66,24.56 28.83,24.56 28.65,24.38 28.65,22.34 27.71,21.4 27.71,20.95 27.4,20.65 U53.26
$5N133: length 5.8
  Top Layer w0.254: 28.15,26.08 C129.2 28.19,22.58 27.26,21.65 U53.28
